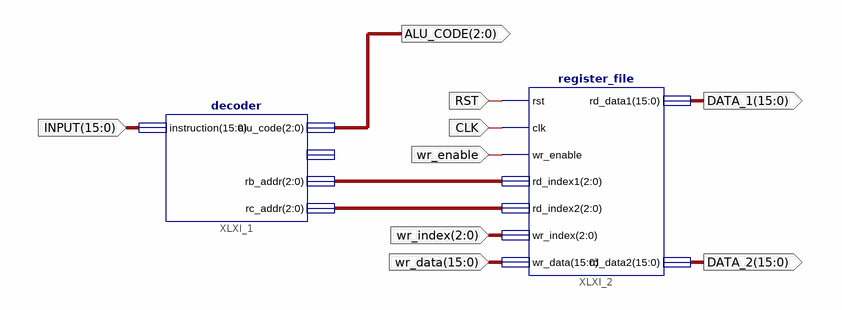
[diagram p0: schematic sheet 1]
// Xilinx ISE schematic decode_test.sch (spartan3e) as structural Verilog: 2 symbols, 9 ports
module decode_test (
  input  [2:0] wr_index,
  input  [15:0] wr_data,
  input  wr_enable,
  input  CLK,
  input  RST,
  input  [15:0] INPUT,
  output [15:0] DATA_1,
  output [15:0] DATA_2,
  output [2:0] ALU_CODE
);

  wire [2:0] XLXN_1, XLXN_2;

  register_file XLXI_2 (
    .rst(RST), .clk(CLK), .wr_enable(wr_enable), .rd_index1(XLXN_1), .rd_index2(XLXN_2), .wr_index(wr_index),
    .wr_data(wr_data), .rd_data1(DATA_1), .rd_data2(DATA_2));
  decoder XLXI_1 (.instruction(INPUT), .alu_code(ALU_CODE), .rb_addr(XLXN_1), .rc_addr(XLXN_2));  // open: ra_addr
endmodule
